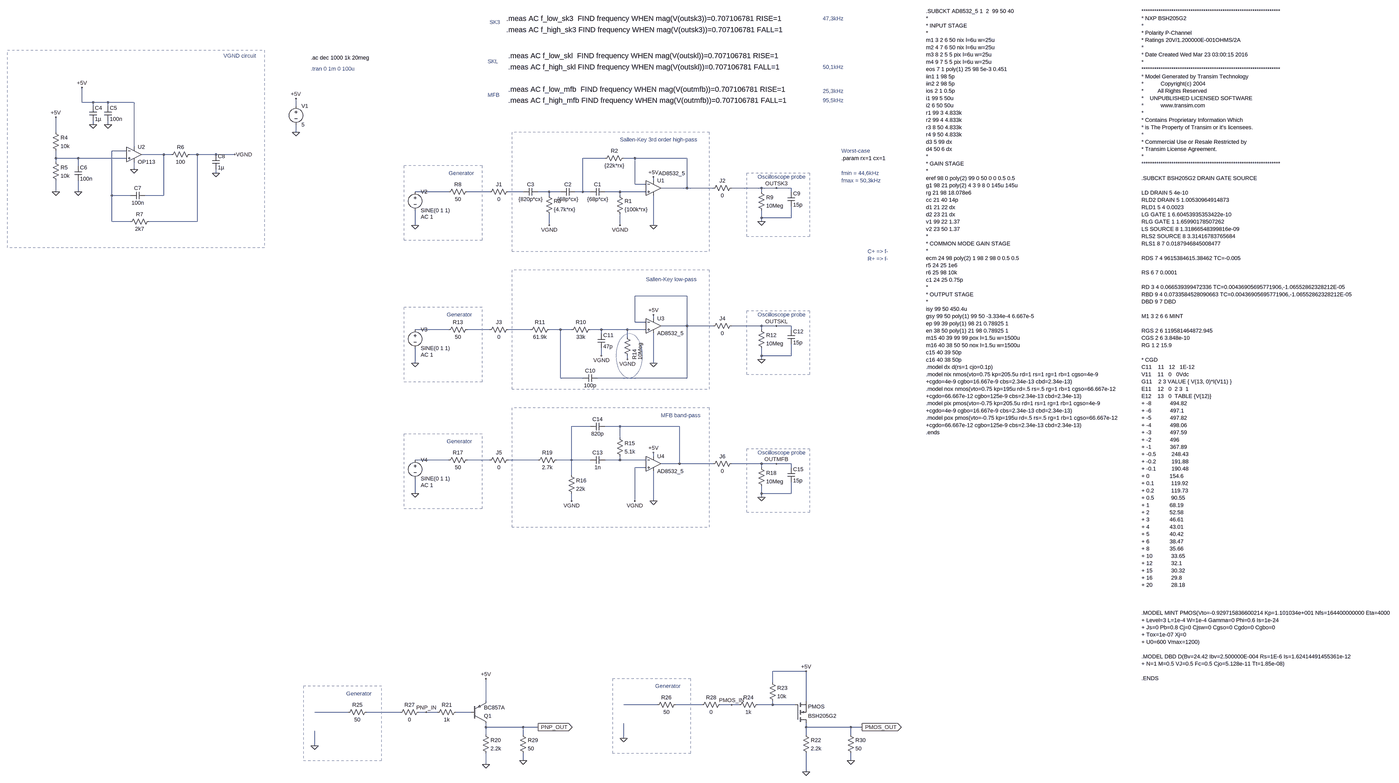
[diagram p0: schematic PUE_LAB_3.asc, whole sheet]
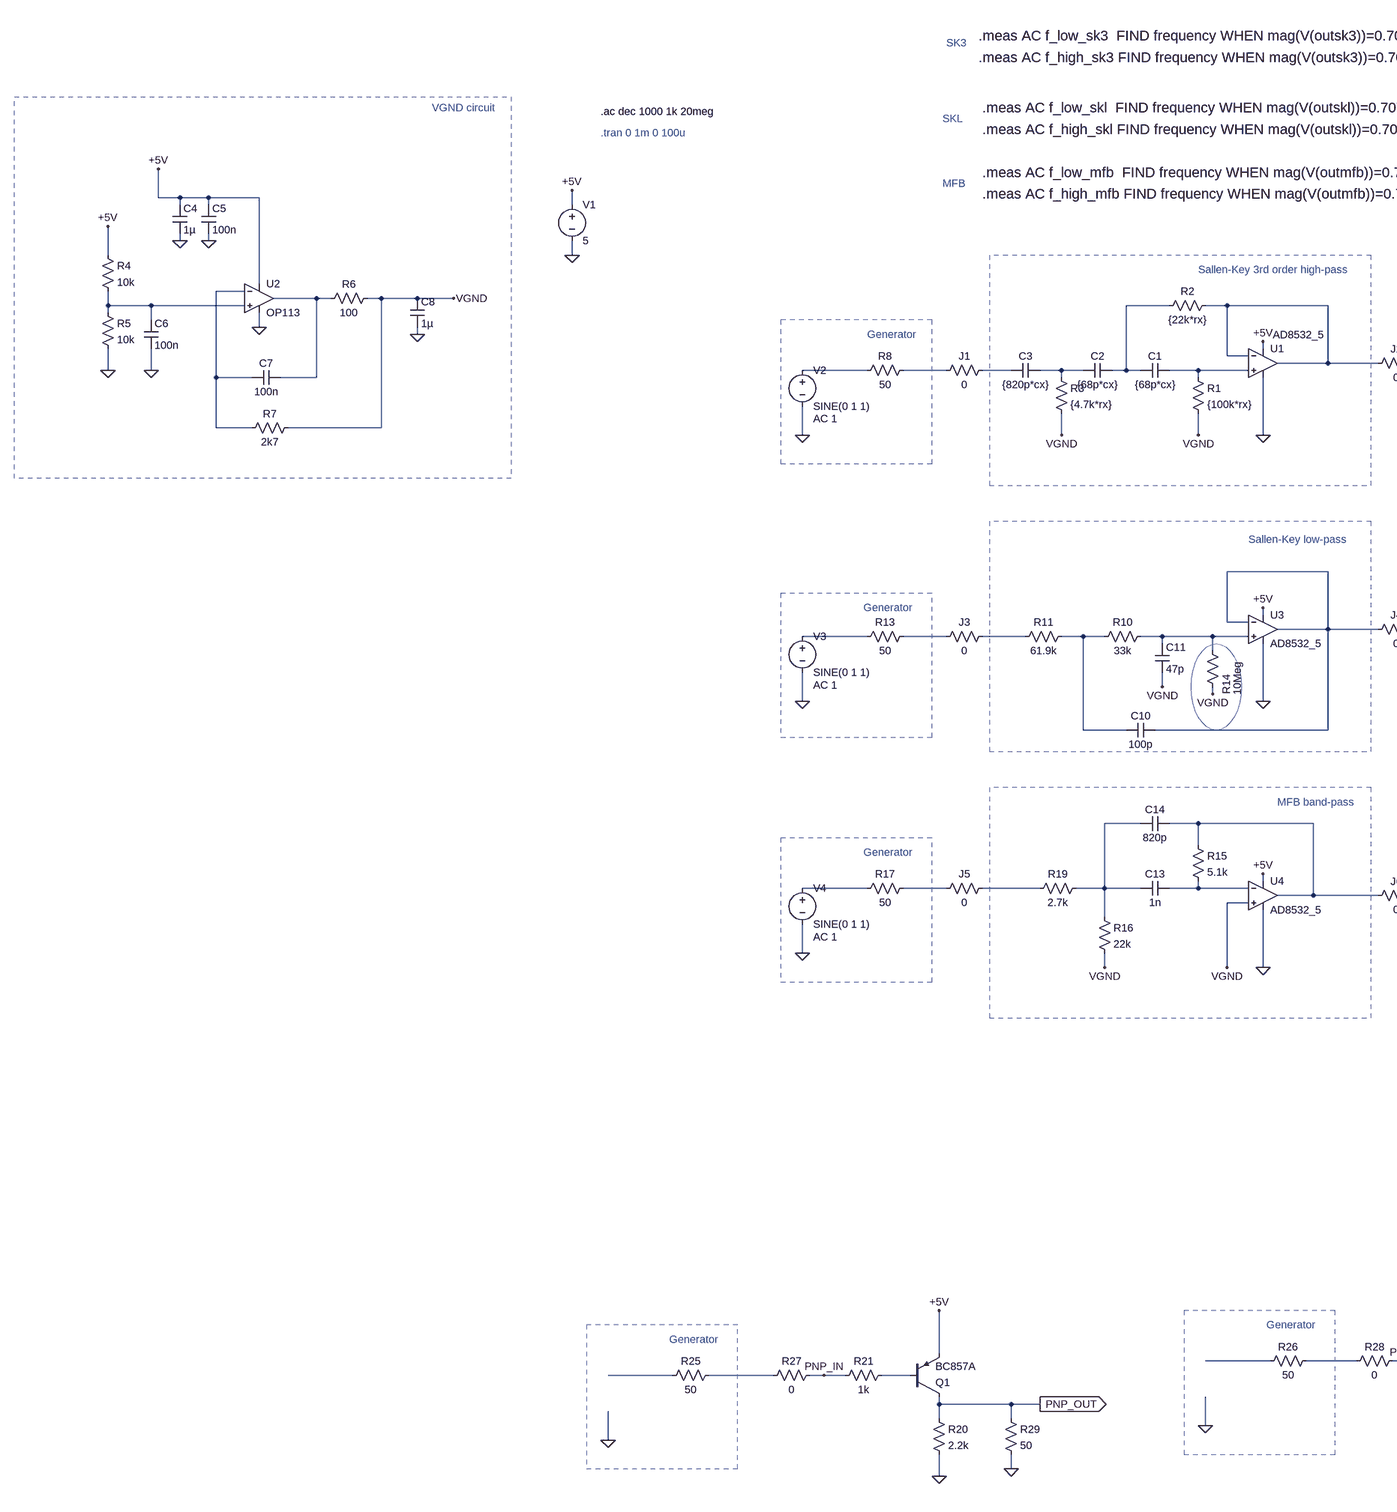
[diagram p1: schematic PUE_LAB_3.asc, part, row 1 of 1, column 1 of 2]
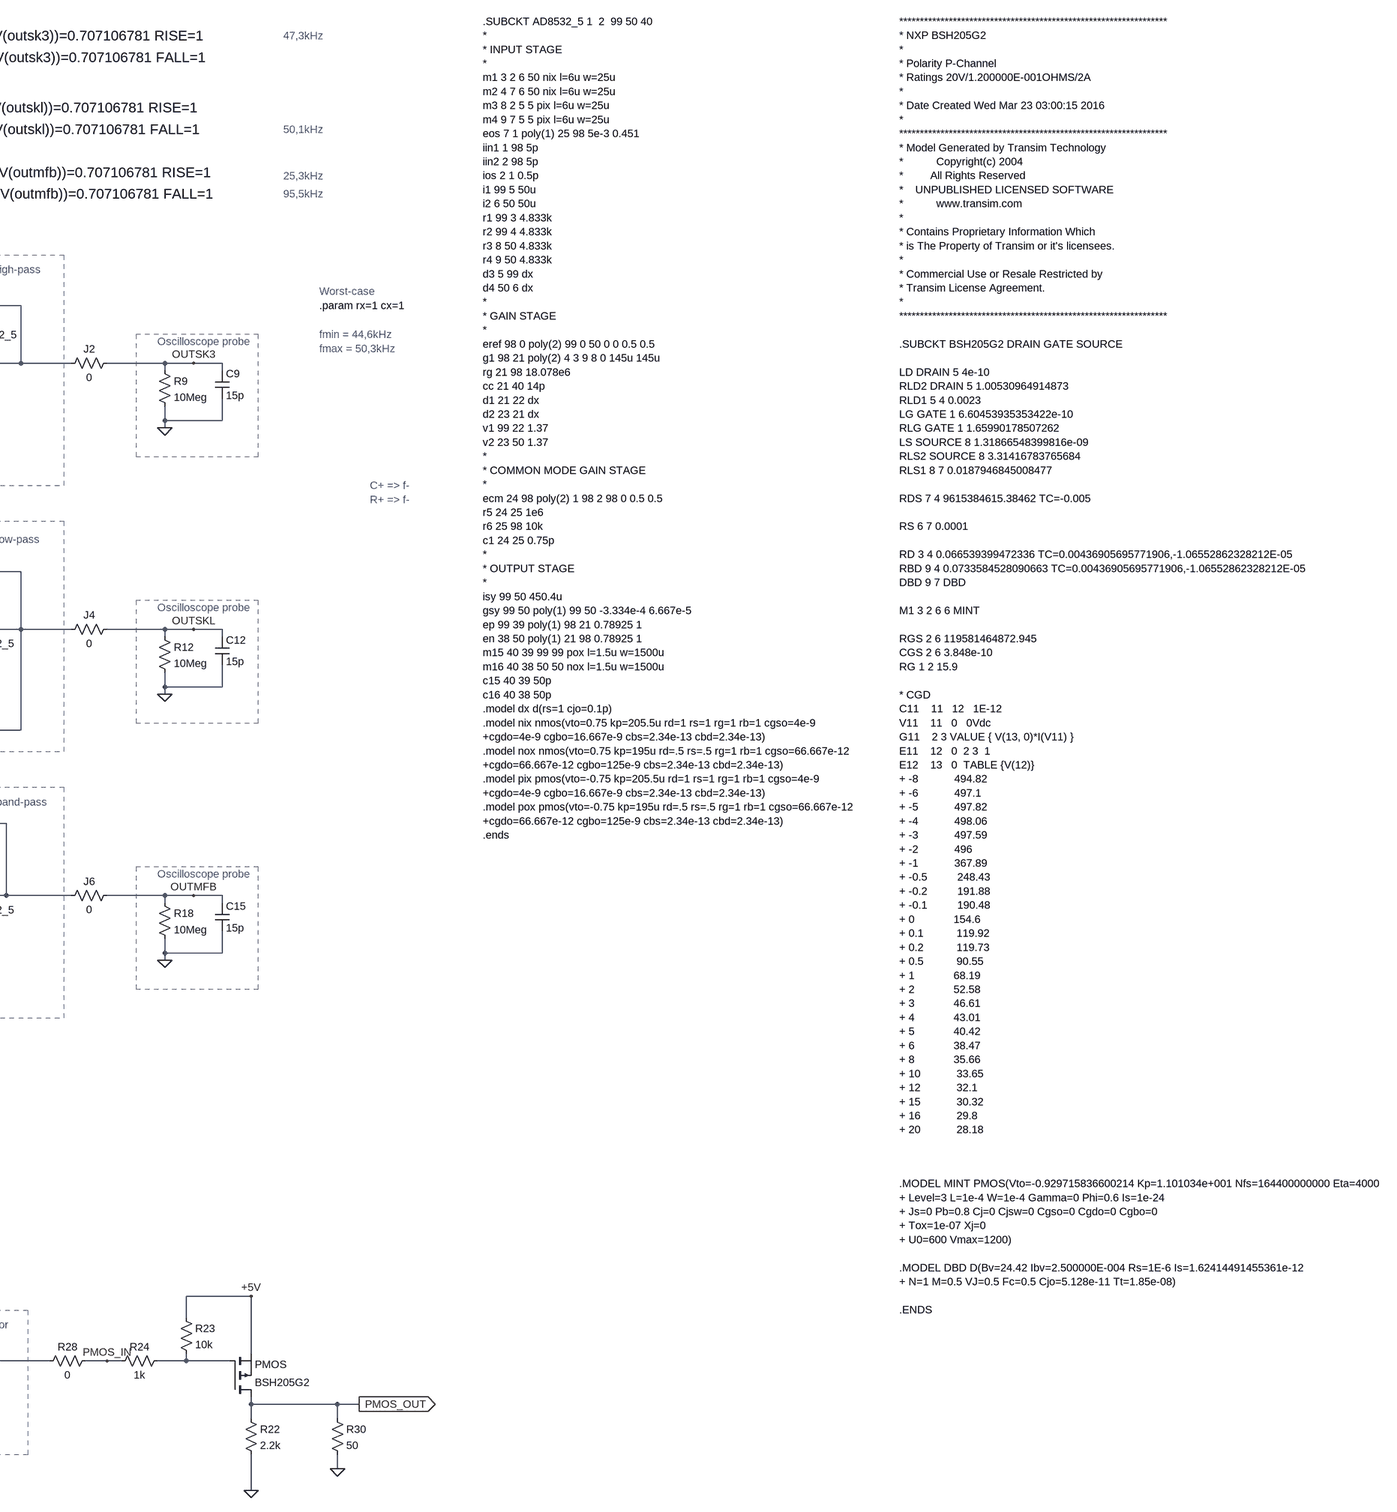
[diagram p2: schematic PUE_LAB_3.asc, part, row 1 of 1, column 2 of 2]
PUE_LAB_3.asc, the LTspice schematic file:
Version 4.1
SHEET 1 3764 3204
WIRE -2176 -176 -2176 -240
WIRE -2128 -176 -2176 -176
WIRE -2064 -176 -2128 -176
WIRE -1952 -176 -2064 -176
WIRE -2128 -160 -2128 -176
WIRE -2064 -160 -2064 -176
WIRE -1248 -160 -1248 -192
WIRE -2128 -80 -2128 -96
WIRE -2064 -80 -2064 -96
WIRE -2288 -48 -2288 -112
WIRE -1248 -48 -1248 -80
WIRE -1952 16 -1952 -176
WIRE -1984 32 -2048 32
WIRE -1824 48 -1920 48
WIRE -1792 48 -1824 48
WIRE -1680 48 -1712 48
WIRE -1600 48 -1680 48
WIRE -1520 48 -1600 48
WIRE -2288 64 -2288 32
WIRE -2192 64 -2288 64
WIRE -1984 64 -2192 64
WIRE 80 64 -16 64
WIRE 208 64 160 64
WIRE 432 64 208 64
WIRE -2288 80 -2288 64
WIRE -2192 96 -2192 64
WIRE -1952 112 -1952 80
WIRE -1600 128 -1600 112
WIRE 288 160 288 144
WIRE 208 176 208 64
WIRE 256 176 208 176
WIRE 432 192 432 64
WIRE 432 192 320 192
WIRE 544 192 432 192
WIRE 752 192 624 192
WIRE 816 192 752 192
WIRE 880 192 816 192
WIRE -2288 208 -2288 160
WIRE -2192 208 -2192 160
WIRE -592 208 -736 208
WIRE -416 208 -512 208
WIRE -272 208 -336 208
WIRE -160 208 -208 208
WIRE -112 208 -160 208
WIRE -16 208 -16 64
WIRE -16 208 -48 208
WIRE 16 208 -16 208
WIRE 144 208 80 208
WIRE 256 208 144 208
WIRE 752 208 752 192
WIRE 880 208 880 192
WIRE -2048 224 -2048 32
WIRE -1968 224 -2048 224
WIRE -1824 224 -1824 48
WIRE -1824 224 -1904 224
WIRE -160 224 -160 208
WIRE 144 224 144 208
WIRE 752 320 752 288
WIRE 880 320 880 272
WIRE 880 320 752 320
WIRE -2048 336 -2048 224
WIRE -1968 336 -2048 336
WIRE -1680 336 -1680 48
WIRE -1680 336 -1888 336
WIRE 752 336 752 320
WIRE -736 352 -736 288
WIRE -160 352 -160 304
WIRE 144 352 144 304
WIRE 288 352 288 224
WIRE 432 656 208 656
WIRE 288 752 288 736
WIRE 208 768 208 656
WIRE 256 768 208 768
WIRE 432 784 432 656
WIRE 432 784 320 784
WIRE 544 784 432 784
WIRE 752 784 624 784
WIRE 816 784 752 784
WIRE 880 784 816 784
WIRE -592 800 -736 800
WIRE -416 800 -512 800
WIRE -240 800 -336 800
WIRE -112 800 -160 800
WIRE -64 800 -112 800
WIRE 64 800 16 800
WIRE 176 800 64 800
WIRE 256 800 176 800
WIRE 752 800 752 784
WIRE 880 800 880 784
WIRE 64 816 64 800
WIRE 176 832 176 800
WIRE 64 912 64 880
WIRE 752 912 752 880
WIRE 880 912 880 864
WIRE 880 912 752 912
WIRE 176 928 176 912
WIRE 752 928 752 912
WIRE -736 944 -736 880
WIRE 288 944 288 816
WIRE -112 1008 -112 800
WIRE -16 1008 -112 1008
WIRE 432 1008 432 784
WIRE 432 1008 48 1008
WIRE 16 1216 -64 1216
WIRE 144 1216 80 1216
WIRE 400 1216 144 1216
WIRE 144 1264 144 1216
WIRE 288 1344 288 1328
WIRE -592 1360 -736 1360
WIRE -416 1360 -512 1360
WIRE -208 1360 -336 1360
WIRE -64 1360 -64 1216
WIRE -64 1360 -128 1360
WIRE 16 1360 -64 1360
WIRE 144 1360 144 1344
WIRE 144 1360 80 1360
WIRE 256 1360 144 1360
WIRE 400 1376 400 1216
WIRE 400 1376 320 1376
WIRE 544 1376 400 1376
WIRE 752 1376 624 1376
WIRE 816 1376 752 1376
WIRE 880 1376 816 1376
WIRE 256 1392 208 1392
WIRE 752 1392 752 1376
WIRE 880 1392 880 1376
WIRE -64 1424 -64 1360
WIRE -736 1504 -736 1440
WIRE 752 1504 752 1472
WIRE 880 1504 880 1456
WIRE 880 1504 752 1504
WIRE 752 1520 752 1504
WIRE -64 1536 -64 1504
WIRE 208 1536 208 1392
WIRE 288 1536 288 1408
WIRE 944 2272 800 2272
WIRE 800 2320 800 2272
WIRE -432 2400 -432 2304
WIRE 944 2400 944 2272
WIRE 304 2416 160 2416
WIRE 496 2416 384 2416
WIRE 624 2416 576 2416
WIRE 656 2416 624 2416
WIRE 800 2416 800 2400
WIRE 800 2416 736 2416
WIRE 896 2416 800 2416
WIRE -1024 2448 -1168 2448
WIRE -800 2448 -944 2448
WIRE -688 2448 -720 2448
WIRE -640 2448 -688 2448
WIRE -496 2448 -560 2448
WIRE -432 2512 -432 2496
WIRE -272 2512 -432 2512
WIRE -208 2512 -272 2512
WIRE 944 2512 944 2496
WIRE 1136 2512 944 2512
WIRE 1184 2512 1136 2512
WIRE -432 2544 -432 2512
WIRE -272 2544 -272 2512
WIRE 944 2544 944 2512
WIRE 1136 2544 1136 2512
WIRE 160 2560 160 2496
WIRE -1168 2592 -1168 2528
WIRE -272 2656 -272 2624
WIRE 1136 2656 1136 2624
WIRE -432 2672 -432 2624
WIRE 944 2704 944 2624
FLAG 288 352 0
FLAG 288 144 +5V
FLAG -1248 -192 +5V
FLAG -1248 -48 0
FLAG 144 352 VGND
FLAG -160 352 VGND
FLAG -1952 112 0
FLAG -2176 -240 +5V
FLAG -2128 -80 0
FLAG -2064 -80 0
FLAG -2288 208 0
FLAG -2192 208 0
FLAG -1600 128 0
FLAG -1520 48 VGND
FLAG -2288 -112 +5V
FLAG 752 336 0
FLAG -736 352 0
FLAG 816 192 OUTSK3
FLAG 288 944 0
FLAG 288 736 +5V
FLAG 64 912 VGND
FLAG -736 944 0
FLAG 752 928 0
FLAG 816 784 OUTSKL
FLAG 176 928 VGND
FLAG 288 1536 0
FLAG 288 1328 +5V
FLAG -736 1504 0
FLAG 752 1520 0
FLAG 816 1376 OUTMFB
FLAG 208 1536 VGND
FLAG -64 1536 VGND
FLAG -432 2672 0
FLAG -432 2304 +5V
FLAG 944 2704 0
FLAG 944 2272 +5V
FLAG 1184 2512 PMOS_OUT
IOPIN 1184 2512 Out
FLAG -208 2512 PNP_OUT
IOPIN -208 2512 Out
FLAG -1168 2592 0
FLAG 160 2560 0
FLAG -688 2448 PNP_IN
FLAG 624 2416 PMOS_IN
FLAG 1136 2656 0
FLAG -272 2656 0
SYMBOL OpAmps\\opamp2 288 128 R0
WINDOW 3 22 1 Left 2
SYMATTR Value AD8532_5
SYMATTR InstName U1
SYMBOL voltage -1248 -176 R0
WINDOW 123 0 0 Left 0
WINDOW 39 0 0 Left 0
SYMATTR InstName V1
SYMATTR Value 5
SYMBOL res 128 208 R0
SYMATTR InstName R1
SYMATTR Value {100k*rx}
SYMBOL cap 80 192 R90
WINDOW 0 0 32 VBottom 2
WINDOW 3 32 32 VTop 2
SYMATTR InstName C1
SYMATTR Value {68p*cx}
SYMBOL res 176 48 R90
WINDOW 0 0 56 VBottom 2
WINDOW 3 32 56 VTop 2
SYMATTR InstName R2
SYMATTR Value {22k*rx}
SYMBOL cap -48 192 R90
WINDOW 0 0 32 VBottom 2
WINDOW 3 32 32 VTop 2
SYMATTR InstName C2
SYMATTR Value {68p*cx}
SYMBOL res -176 208 R0
SYMATTR InstName R3
SYMATTR Value {4.7k*rx}
SYMBOL cap -208 192 R90
WINDOW 0 0 32 VBottom 2
WINDOW 3 32 32 VTop 2
SYMATTR InstName C3
SYMATTR Value {820p*cx}
SYMBOL OpAmps\\OP113 -1952 -16 R0
SYMATTR InstName U2
SYMBOL cap -2144 -160 R0
SYMATTR InstName C4
SYMATTR Value 1µ
SYMBOL cap -2080 -160 R0
SYMATTR InstName C5
SYMATTR Value 100n
SYMBOL res -2304 -64 R0
SYMATTR InstName R4
SYMATTR Value 10k
SYMBOL res -2304 64 R0
SYMATTR InstName R5
SYMATTR Value 10k
SYMBOL cap -2208 96 R0
SYMATTR InstName C6
SYMATTR Value 100n
SYMBOL cap -1904 208 R90
WINDOW 0 0 32 VBottom 2
WINDOW 3 32 32 VTop 2
SYMATTR InstName C7
SYMATTR Value 100n
SYMBOL res -1696 32 R90
WINDOW 0 0 56 VBottom 2
WINDOW 3 32 56 VTop 2
SYMATTR InstName R6
SYMATTR Value 100
SYMBOL res -1872 320 R90
WINDOW 0 0 56 VBottom 2
WINDOW 3 32 56 VTop 2
SYMATTR InstName R7
SYMATTR Value 2k7
SYMBOL cap -1616 48 R0
SYMATTR InstName C8
SYMATTR Value 1µ
SYMBOL res -496 192 R90
WINDOW 0 0 56 VBottom 2
WINDOW 3 32 56 VTop 2
SYMATTR InstName R8
SYMATTR Value 50
SYMBOL res 736 192 R0
SYMATTR InstName R9
SYMATTR Value 10Meg
SYMBOL cap 864 208 R0
SYMATTR InstName C9
SYMATTR Value 15p
SYMBOL voltage -736 192 R0
WINDOW 123 24 124 Left 2
WINDOW 39 0 0 Left 0
SYMATTR Value2 AC 1
SYMATTR InstName V2
SYMATTR Value SINE(0 1 1)
SYMBOL res 640 176 R90
WINDOW 0 0 56 VBottom 2
WINDOW 3 32 56 VTop 2
SYMATTR InstName J2
SYMATTR Value 0
SYMBOL res -320 192 R90
WINDOW 0 0 56 VBottom 2
WINDOW 3 32 56 VTop 2
SYMATTR InstName J1
SYMATTR Value 0
SYMBOL cap 48 992 R90
WINDOW 0 0 32 VBottom 2
WINDOW 3 32 32 VTop 2
SYMATTR InstName C10
SYMATTR Value 100p
SYMBOL res 32 784 R90
WINDOW 0 0 56 VBottom 2
WINDOW 3 32 56 VTop 2
SYMATTR InstName R10
SYMATTR Value 33k
SYMBOL cap 48 816 R0
SYMATTR InstName C11
SYMATTR Value 47p
SYMBOL res -144 784 R90
WINDOW 0 0 56 VBottom 2
WINDOW 3 32 56 VTop 2
SYMATTR InstName R11
SYMATTR Value 61.9k
SYMBOL res -320 784 R90
WINDOW 0 0 56 VBottom 2
WINDOW 3 32 56 VTop 2
SYMATTR InstName J3
SYMATTR Value 0
SYMBOL res 640 768 R90
WINDOW 0 0 56 VBottom 2
WINDOW 3 32 56 VTop 2
SYMATTR InstName J4
SYMATTR Value 0
SYMBOL res -496 784 R90
WINDOW 0 0 56 VBottom 2
WINDOW 3 32 56 VTop 2
SYMATTR InstName R13
SYMATTR Value 50
SYMBOL voltage -736 784 R0
WINDOW 123 24 124 Left 2
WINDOW 39 0 0 Left 0
SYMATTR Value2 AC 1
SYMATTR InstName V3
SYMATTR Value SINE(0 1 1)
SYMBOL res 736 784 R0
SYMATTR InstName R12
SYMATTR Value 10Meg
SYMBOL cap 864 800 R0
SYMATTR InstName C12
SYMATTR Value 15p
SYMBOL OpAmps\\opamp2 288 720 R0
SYMATTR InstName U3
SYMATTR Value AD8532_5
SYMBOL res 160 816 R0
WINDOW 0 47 112 VLeft 2
WINDOW 3 71 114 VLeft 2
SYMATTR InstName R14
SYMATTR Value 10Meg
SYMBOL res -320 1344 R90
WINDOW 0 0 56 VBottom 2
WINDOW 3 32 56 VTop 2
SYMATTR InstName J5
SYMATTR Value 0
SYMBOL res 640 1360 R90
WINDOW 0 0 56 VBottom 2
WINDOW 3 32 56 VTop 2
SYMATTR InstName J6
SYMATTR Value 0
SYMBOL res -496 1344 R90
WINDOW 0 0 56 VBottom 2
WINDOW 3 32 56 VTop 2
SYMATTR InstName R17
SYMATTR Value 50
SYMBOL voltage -736 1344 R0
WINDOW 123 24 124 Left 2
WINDOW 39 0 0 Left 0
SYMATTR Value2 AC 1
SYMATTR InstName V4
SYMATTR Value SINE(0 1 1)
SYMBOL res 736 1376 R0
SYMATTR InstName R18
SYMATTR Value 10Meg
SYMBOL cap 864 1392 R0
SYMATTR InstName C15
SYMATTR Value 15p
SYMBOL OpAmps\\opamp2 288 1312 R0
SYMATTR InstName U4
SYMATTR Value AD8532_5
SYMBOL res 128 1248 R0
SYMATTR InstName R15
SYMATTR Value 5.1k
SYMBOL cap 80 1344 R90
WINDOW 0 0 32 VBottom 2
WINDOW 3 32 32 VTop 2
SYMATTR InstName C13
SYMATTR Value 1n
SYMBOL cap 80 1200 R90
WINDOW 0 0 32 VBottom 2
WINDOW 3 32 32 VTop 2
SYMATTR InstName C14
SYMATTR Value 820p
SYMBOL res -80 1408 R0
SYMATTR InstName R16
SYMATTR Value 22k
SYMBOL res -112 1344 R90
WINDOW 0 0 56 VBottom 2
WINDOW 3 32 56 VTop 2
SYMATTR InstName R19
SYMATTR Value 2.7k
SYMBOL pnp -496 2496 M180
SYMATTR InstName Q1
SYMATTR Value BC857A
SYMBOL pmos 896 2496 M180
SYMATTR InstName BSH205G2
SYMBOL res -448 2528 R0
SYMATTR InstName R20
SYMATTR Value 2.2k
SYMBOL res -544 2432 R90
WINDOW 0 0 56 VBottom 2
WINDOW 3 32 56 VTop 2
SYMATTR InstName R21
SYMATTR Value 1k
SYMBOL res 928 2528 R0
SYMATTR InstName R22
SYMATTR Value 2.2k
SYMBOL res 784 2304 R0
SYMATTR InstName R23
SYMATTR Value 10k
SYMBOL res 752 2400 R90
WINDOW 0 0 56 VBottom 2
WINDOW 3 32 56 VTop 2
SYMATTR InstName R24
SYMATTR Value 1k
SYMBOL res -928 2432 R90
WINDOW 0 0 56 VBottom 2
WINDOW 3 32 56 VTop 2
SYMATTR InstName R25
SYMATTR Value 50
SYMBOL res 400 2400 R90
WINDOW 0 0 56 VBottom 2
WINDOW 3 32 56 VTop 2
SYMATTR InstName R26
SYMATTR Value 50
SYMBOL res -704 2432 R90
WINDOW 0 0 56 VBottom 2
WINDOW 3 32 56 VTop 2
SYMATTR InstName R27
SYMATTR Value 0
SYMBOL res 592 2400 R90
WINDOW 0 0 56 VBottom 2
WINDOW 3 32 56 VTop 2
SYMATTR InstName R28
SYMATTR Value 0
SYMBOL res -288 2528 R0
SYMATTR InstName R29
SYMATTR Value 50
SYMBOL res 1120 2528 R0
SYMATTR InstName R30
SYMATTR Value 50
TEXT 1664 -568 Left 2 !.SUBCKT AD8532_5 1  2  99 50 40\n*\n* INPUT STAGE\n*\nm1 3 2 6 50 nix l=6u w=25u\nm2 4 7 6 50 nix l=6u w=25u\nm3 8 2 5 5 pix l=6u w=25u\nm4 9 7 5 5 pix l=6u w=25u\neos 7 1 poly(1) 25 98 5e-3 0.451\niin1 1 98 5p\niin2 2 98 5p\nios 2 1 0.5p\ni1 99 5 50u\ni2 6 50 50u\nr1 99 3 4.833k\nr2 99 4 4.833k\nr3 8 50 4.833k\nr4 9 50 4.833k\nd3 5 99 dx\nd4 50 6 dx\n*\n* GAIN STAGE\n*\neref 98 0 poly(2) 99 0 50 0 0 0.5 0.5\ng1 98 21 poly(2) 4 3 9 8 0 145u 145u\nrg 21 98 18.078e6\ncc 21 40 14p\nd1 21 22 dx\nd2 23 21 dx\nv1 99 22 1.37\nv2 23 50 1.37\n*\n* COMMON MODE GAIN STAGE\n*\necm 24 98 poly(2) 1 98 2 98 0 0.5 0.5\nr5 24 25 1e6\nr6 25 98 10k\nc1 24 25 0.75p\n*\n* OUTPUT STAGE\n*\nisy 99 50 450.4u\ngsy 99 50 poly(1) 99 50 -3.334e-4 6.667e-5\nep 99 39 poly(1) 98 21 0.78925 1\nen 38 50 poly(1) 21 98 0.78925 1\nm15 40 39 99 99 pox l=1.5u w=1500u\nm16 40 38 50 50 nox l=1.5u w=1500u\nc15 40 39 50p\nc16 40 38 50p\n.model dx d(rs=1 cjo=0.1p)\n.model nix nmos(vto=0.75 kp=205.5u rd=1 rs=1 rg=1 rb=1 cgso=4e-9\n+cgdo=4e-9 cgbo=16.667e-9 cbs=2.34e-13 cbd=2.34e-13)\n.model nox nmos(vto=0.75 kp=195u rd=.5 rs=.5 rg=1 rb=1 cgso=66.667e-12\n+cgdo=66.667e-12 cgbo=125e-9 cbs=2.34e-13 cbd=2.34e-13)\n.model pix pmos(vto=-0.75 kp=205.5u rd=1 rs=1 rg=1 rb=1 cgso=4e-9\n+cgdo=4e-9 cgbo=16.667e-9 cbs=2.34e-13 cbd=2.34e-13)\n.model pox pmos(vto=-0.75 kp=195u rd=.5 rs=.5 rg=1 rb=1 cgso=66.667e-12\n+cgdo=66.667e-12 cgbo=125e-9 cbs=2.34e-13 cbd=2.34e-13)\n.ends
TEXT -1184 -320 Left 2 ;.tran 0 1m 0 100u
TEXT -1184 -368 Left 2 !.ac dec 1000 1k 20meg
TEXT -344 -536 Left 3 !.meas AC f_low_sk3  FIND frequency WHEN mag(V(outsk3))=0.707106781 RISE=1
TEXT -344 -488 Left 3 !.meas AC f_high_sk3 FIND frequency WHEN mag(V(outsk3))=0.707106781 FALL=1
TEXT -1568 -376 Left 2 ;VGND circuit
TEXT 736 144 Left 2 ;Oscilloscope probe
TEXT 144 -16 Left 2 ;Sallen-Key 3rd order high-pass
TEXT 256 584 Left 2 ;Sallen-Key low-pass
TEXT 736 736 Left 2 ;Oscilloscope probe
TEXT -336 -376 Left 3 !.meas AC f_low_skl  FIND frequency WHEN mag(V(outskl))=0.707106781 RISE=1
TEXT -336 -328 Left 3 !.meas AC f_high_skl FIND frequency WHEN mag(V(outskl))=0.707106781 FALL=1
TEXT 1016 -536 Left 2 ;47,3kHz
TEXT 1016 -328 Left 2 ;50,1kHz
TEXT 320 1168 Left 2 ;MFB band-pass
TEXT 736 1328 Left 2 ;Oscilloscope probe
TEXT -336 -232 Left 3 !.meas AC f_low_mfb  FIND frequency WHEN mag(V(outmfb))=0.707106781 RISE=1
TEXT -336 -184 Left 3 !.meas AC f_high_mfb FIND frequency WHEN mag(V(outmfb))=0.707106781 FALL=1
TEXT 1016 -184 Left 2 ;95,5kHz
TEXT 1016 -224 Left 2 ;25,3kHz
TEXT -416 -520 Left 2 ;SK3
TEXT -424 -352 Left 2 ;SKL
TEXT -424 -208 Left 2 ;MFB
TEXT 1096 32 Left 2 ;Worst-case
TEXT 1208 464 Left 2 ;C+ => f-
TEXT 1208 496 Left 2 ;R+ => f-
TEXT 1096 64 Left 2 !.param rx=1 cx=1
TEXT 1096 128 Left 2 ;fmin = 44,6kHz
TEXT 1096 160 Left 2 ;fmax = 50,3kHz
TEXT -592 128 Left 2 ;Generator
TEXT -600 736 Left 2 ;Generator
TEXT -600 1280 Left 2 ;Generator
TEXT 2600 -568 Left 2 !*****************************************************************\n* NXP BSH205G2\n*\n* Polarity P-Channel\n* Ratings 20V/1.200000E-001OHMS/2A\n*\n* Date Created Wed Mar 23 03:00:15 2016\n*\n*****************************************************************\n* Model Generated by Transim Technology\n*           Copyright(c) 2004\n*         All Rights Reserved\n*    UNPUBLISHED LICENSED SOFTWARE\n*           www.transim.com\n*\n* Contains Proprietary Information Which\n* is The Property of Transim or it's licensees.\n*\n* Commercial Use or Resale Restricted by\n* Transim License Agreement.\n*\n*****************************************************************\n \n.SUBCKT BSH205G2 DRAIN GATE SOURCE\n \nLD DRAIN 5 4e-10\nRLD2 DRAIN 5 1.00530964914873\nRLD1 5 4 0.0023\nLG GATE 1 6.60453935353422e-10\nRLG GATE 1 1.65990178507262\nLS SOURCE 8 1.31866548399816e-09\nRLS2 SOURCE 8 3.31416783765684\nRLS1 8 7 0.0187946845008477\n \nRDS 7 4 9615384615.38462 TC=-0.005\n \nRS 6 7 0.0001\n \nRD 3 4 0.066539399472336 TC=0.00436905695771906,-1.06552862328212E-05\nRBD 9 4 0.0733584528090663 TC=0.00436905695771906,-1.06552862328212E-05\nDBD 9 7 DBD\n \nM1 3 2 6 6 MINT\n \nRGS 2 6 119581464872.945\nCGS 2 6 3.848e-10\nRG 1 2 15.9\n \n* CGD\nC11    11   12   1E-12\nV11    11   0   0Vdc\nG11    2 3 VALUE { V(13, 0)*I(V11) }\nE11    12   0  2 3  1\nE12    13   0  TABLE {V(12)}\n+ -8            494.82\n+ -6            497.1\n+ -5            497.82\n+ -4            498.06\n+ -3            497.59\n+ -2            496\n+ -1            367.89\n+ -0.5          248.43\n+ -0.2          191.88\n+ -0.1          190.48\n+ 0             154.6\n+ 0.1           119.92\n+ 0.2           119.73\n+ 0.5           90.55\n+ 1             68.19\n+ 2             52.58\n+ 3             46.61\n+ 4             43.01\n+ 5             40.42\n+ 6             38.47\n+ 8             35.66\n+ 10            33.65\n+ 12            32.1\n+ 15            30.32\n+ 16            29.8\n+ 20            28.18\n \n\n \n.MODEL MINT PMOS(Vto=-0.929715836600214 Kp=1.101034e+001 Nfs=164400000000 Eta=4000\n+ Level=3 L=1e-4 W=1e-4 Gamma=0 Phi=0.6 Is=1e-24\n+ Js=0 Pb=0.8 Cj=0 Cjsw=0 Cgso=0 Cgdo=0 Cgbo=0\n+ Tox=1e-07 Xj=0\n+ U0=600 Vmax=1200)\n \n.MODEL DBD D(Bv=24.42 Ibv=2.500000E-004 Rs=1E-6 Is=1.62414491455361e-12\n+ N=1 M=0.5 VJ=0.5 Fc=0.5 Cjo=5.128e-11 Tt=1.85e-08)\n \n.ENDS
TEXT -1032 2368 Left 2 ;Generator
TEXT 296 2336 Left 2 ;Generator
RECTANGLE Normal 688 400 960 128 2
RECTANGLE Normal -1392 448 -2496 -400 2
RECTANGLE Normal -320 464 528 -48 2
RECTANGLE Normal -320 1056 528 544 2
RECTANGLE Normal 688 992 960 720 2
RECTANGLE Normal -320 1648 528 1136 2
RECTANGLE Normal 688 1584 960 1312 2
RECTANGLE Normal -448 96 -784 416 2
RECTANGLE Normal -448 704 -784 1024 2
RECTANGLE Normal -448 1248 -784 1568 2
RECTANGLE Normal -880 2336 -1216 2656 2
RECTANGLE Normal 448 2304 112 2624 2
CIRCLE Normal 240 1008 128 816 1

The netlist it stands for:
* PUE_LAB_3.asc
X§U1 N010 N005 +5V 0 N005 AD8532_5  ; pins In+ In- V+ V- OUT
V1 +5V 0 5
R1 N010 VGND {100k*rx}
C1 N010 N004 {68p*cx}
R2 N005 N004 {22k*rx}
C2 N004 N009 {68p*cx}
R3 N009 VGND {4.7k*rx}
C3 N009 N008 {820p*cx}
X§U2 N003 N001 +5V 0 N002 OP113  ; pins In+ In- V+ V- OUT
C4 +5V 0 1µ
C5 +5V 0 100n
R4 +5V N003 10k
R5 N003 0 10k
C6 N003 0 100n
C7 N002 N001 100n
R6 VGND N002 100
R7 VGND N001 2k7
C8 VGND 0 1µ
R8 N007 N006 50
R9 OUTSK3 0 10Meg
C9 OUTSK3 0 15p
V2 N006 0 SINE(0 1 1) AC 1
R§J2 OUTSK3 N005 0
R§J1 N008 N007 0
C10 N011 N015 100p
R10 N016 N015 33k
C11 N016 VGND 47p
R11 N015 N014 61.9k
R§J3 N014 N013 0
R§J4 OUTSKL N011 0
R13 N013 N012 50
V3 N012 0 SINE(0 1 1) AC 1
R12 OUTSKL 0 10Meg
C12 OUTSKL 0 15p
X§U3 N016 N011 +5V 0 N011 AD8532_5  ; pins In+ In- V+ V- OUT
R14 N016 VGND 10Meg
R§J5 N021 N020 0
R§J6 OUTMFB N018 0
R17 N020 N019 50
V4 N019 0 SINE(0 1 1) AC 1
R18 OUTMFB 0 10Meg
C15 OUTMFB 0 15p
X§U4 VGND N022 +5V 0 N018 AD8532_5  ; pins In+ In- V+ V- OUT
R15 N018 N022 5.1k
C13 N022 N017 1n
C14 N018 N017 820p
R16 N017 VGND 22k
R19 N017 N021 2.7k
Q1 PNP_OUT N028 +5V 0 BC857A
M§BSH205G2 PMOS_OUT N025 +5V +5V PMOS
R20 PNP_OUT 0 2.2k
R21 N028 PNP_IN 1k
R22 PMOS_OUT 0 2.2k
R23 +5V N025 10k
R24 N025 PMOS_IN 1k
R25 N027 N026 50
R26 N024 N023 50
R27 PNP_IN N027 0
R28 PMOS_IN N024 0
R29 PNP_OUT 0 50
R30 PMOS_OUT 0 50
.model NPN NPN
.model PNP PNP
.lib standard.bjt
.model NMOS NMOS
.model PMOS PMOS
.lib standard.mos
.SUBCKT AD8532_5 1  2  99 50 40
*
* INPUT STAGE
*
m1 3 2 6 50 nix l=6u w=25u
m2 4 7 6 50 nix l=6u w=25u
m3 8 2 5 5 pix l=6u w=25u
m4 9 7 5 5 pix l=6u w=25u
eos 7 1 poly(1) 25 98 5e-3 0.451
iin1 1 98 5p
iin2 2 98 5p
ios 2 1 0.5p
i1 99 5 50u
i2 6 50 50u
r1 99 3 4.833k
r2 99 4 4.833k
r3 8 50 4.833k
r4 9 50 4.833k
d3 5 99 dx
d4 50 6 dx
*
* GAIN STAGE
*
eref 98 0 poly(2) 99 0 50 0 0 0.5 0.5
g1 98 21 poly(2) 4 3 9 8 0 145u 145u
rg 21 98 18.078e6
cc 21 40 14p
d1 21 22 dx
d2 23 21 dx
v1 99 22 1.37
v2 23 50 1.37
*
* COMMON MODE GAIN STAGE
*
ecm 24 98 poly(2) 1 98 2 98 0 0.5 0.5
r5 24 25 1e6
r6 25 98 10k
c1 24 25 0.75p
*
* OUTPUT STAGE
*
isy 99 50 450.4u
gsy 99 50 poly(1) 99 50 -3.334e-4 6.667e-5
ep 99 39 poly(1) 98 21 0.78925 1
en 38 50 poly(1) 21 98 0.78925 1
m15 40 39 99 99 pox l=1.5u w=1500u
m16 40 38 50 50 nox l=1.5u w=1500u
c15 40 39 50p
c16 40 38 50p
.model dx d(rs=1 cjo=0.1p)
.model nix nmos(vto=0.75 kp=205.5u rd=1 rs=1 rg=1 rb=1 cgso=4e-9
+cgdo=4e-9 cgbo=16.667e-9 cbs=2.34e-13 cbd=2.34e-13)
.model nox nmos(vto=0.75 kp=195u rd=.5 rs=.5 rg=1 rb=1 cgso=66.667e-12
+cgdo=66.667e-12 cgbo=125e-9 cbs=2.34e-13 cbd=2.34e-13)
.model pix pmos(vto=-0.75 kp=205.5u rd=1 rs=1 rg=1 rb=1 cgso=4e-9
+cgdo=4e-9 cgbo=16.667e-9 cbs=2.34e-13 cbd=2.34e-13)
.model pox pmos(vto=-0.75 kp=195u rd=.5 rs=.5 rg=1 rb=1 cgso=66.667e-12
+cgdo=66.667e-12 cgbo=125e-9 cbs=2.34e-13 cbd=2.34e-13)
.ends
* .tran 0 1m 0 100u
.ac dec 1000 1k 20meg
.meas AC f_low_sk3  FIND frequency WHEN mag(V(outsk3))=0.707106781 RISE=1
.meas AC f_high_sk3 FIND frequency WHEN mag(V(outsk3))=0.707106781 FALL=1
* VGND circuit
* Oscilloscope probe
* Sallen-Key 3rd order high-pass
* Sallen-Key low-pass
* Oscilloscope probe
.meas AC f_low_skl  FIND frequency WHEN mag(V(outskl))=0.707106781 RISE=1
.meas AC f_high_skl FIND frequency WHEN mag(V(outskl))=0.707106781 FALL=1
* 47,3kHz
* 50,1kHz
* MFB band-pass
* Oscilloscope probe
.meas AC f_low_mfb  FIND frequency WHEN mag(V(outmfb))=0.707106781 RISE=1
.meas AC f_high_mfb FIND frequency WHEN mag(V(outmfb))=0.707106781 FALL=1
* 95,5kHz
* 25,3kHz
* SK3
* SKL
* MFB
* Worst-case
* C+ => f-
* R+ => f-
.param rx=1 cx=1
* fmin = 44,6kHz
* fmax = 50,3kHz
* Generator
* Generator
* Generator
*****************************************************************
* NXP BSH205G2
*
* Polarity P-Channel
* Ratings 20V/1.200000E-001OHMS/2A
*
* Date Created Wed Mar 23 03:00:15 2016
*
*****************************************************************
* Model Generated by Transim Technology
*           Copyright(c) 2004
*         All Rights Reserved
*    UNPUBLISHED LICENSED SOFTWARE
*           www.transim.com
*
* Contains Proprietary Information Which
* is The Property of Transim or it's licensees.
*
* Commercial Use or Resale Restricted by
* Transim License Agreement.
*
*****************************************************************
.SUBCKT BSH205G2 DRAIN GATE SOURCE
LD DRAIN 5 4e-10
RLD2 DRAIN 5 1.00530964914873
RLD1 5 4 0.0023
LG GATE 1 6.60453935353422e-10
RLG GATE 1 1.65990178507262
LS SOURCE 8 1.31866548399816e-09
RLS2 SOURCE 8 3.31416783765684
RLS1 8 7 0.0187946845008477
RDS 7 4 9615384615.38462 TC=-0.005
RS 6 7 0.0001
RD 3 4 0.066539399472336 TC=0.00436905695771906,-1.06552862328212E-05
RBD 9 4 0.0733584528090663 TC=0.00436905695771906,-1.06552862328212E-05
DBD 9 7 DBD
M1 3 2 6 6 MINT
RGS 2 6 119581464872.945
CGS 2 6 3.848e-10
RG 1 2 15.9
* CGD
C11    11   12   1E-12
V11    11   0   0Vdc
G11    2 3 VALUE { V(13, 0)*I(V11) }
E11    12   0  2 3  1
E12    13   0  TABLE {V(12)}
+ -8            494.82
+ -6            497.1
+ -5            497.82
+ -4            498.06
+ -3            497.59
+ -2            496
+ -1            367.89
+ -0.5          248.43
+ -0.2          191.88
+ -0.1          190.48
+ 0             154.6
+ 0.1           119.92
+ 0.2           119.73
+ 0.5           90.55
+ 1             68.19
+ 2             52.58
+ 3             46.61
+ 4             43.01
+ 5             40.42
+ 6             38.47
+ 8             35.66
+ 10            33.65
+ 12            32.1
+ 15            30.32
+ 16            29.8
+ 20            28.18
.MODEL MINT PMOS(Vto=-0.929715836600214 Kp=1.101034e+001 Nfs=164400000000 Eta=4000
+ Level=3 L=1e-4 W=1e-4 Gamma=0 Phi=0.6 Is=1e-24
+ Js=0 Pb=0.8 Cj=0 Cjsw=0 Cgso=0 Cgdo=0 Cgbo=0
+ Tox=1e-07 Xj=0
+ U0=600 Vmax=1200)
.MODEL DBD D(Bv=24.42 Ibv=2.500000E-004 Rs=1E-6 Is=1.62414491455361e-12
+ N=1 M=0.5 VJ=0.5 Fc=0.5 Cjo=5.128e-11 Tt=1.85e-08)
.ENDS
* Generator
* Generator
.lib ADI.lib
.backanno
.end